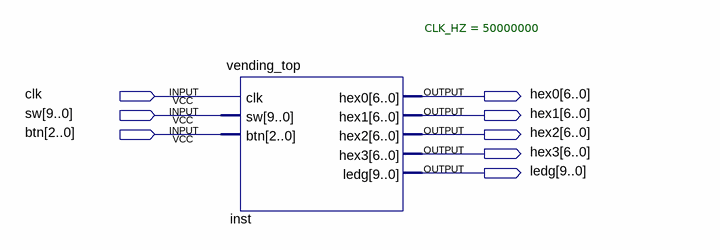
[diagram p0: schematic sheet]
// Quartus schematic vending_io.bdf as structural Verilog: 1 symbols, 8 pins
module vending_io (
  input  clk,
  input  [9:0] sw,
  input  [2:0] btn,
  output [6:0] hex0,
  output [6:0] hex1,
  output [6:0] hex2,
  output [6:0] hex3,
  output [9:0] ledg
);

  vending_top #(.CLK_HZ(50000000)) inst (
    .clk(clk), .sw(sw), .btn(btn), .hex0(hex0), .hex1(hex1), .hex2(hex2), .hex3(hex3), .ledg(ledg));
endmodule
